# Altium project Carrier-Board-v1.0.PrjPcb (part 11 of 15)

## Sheet RS232_RS485_INTERFACE.SchDoc
size A4; SheetNumber: 18; SheetTotal: 27
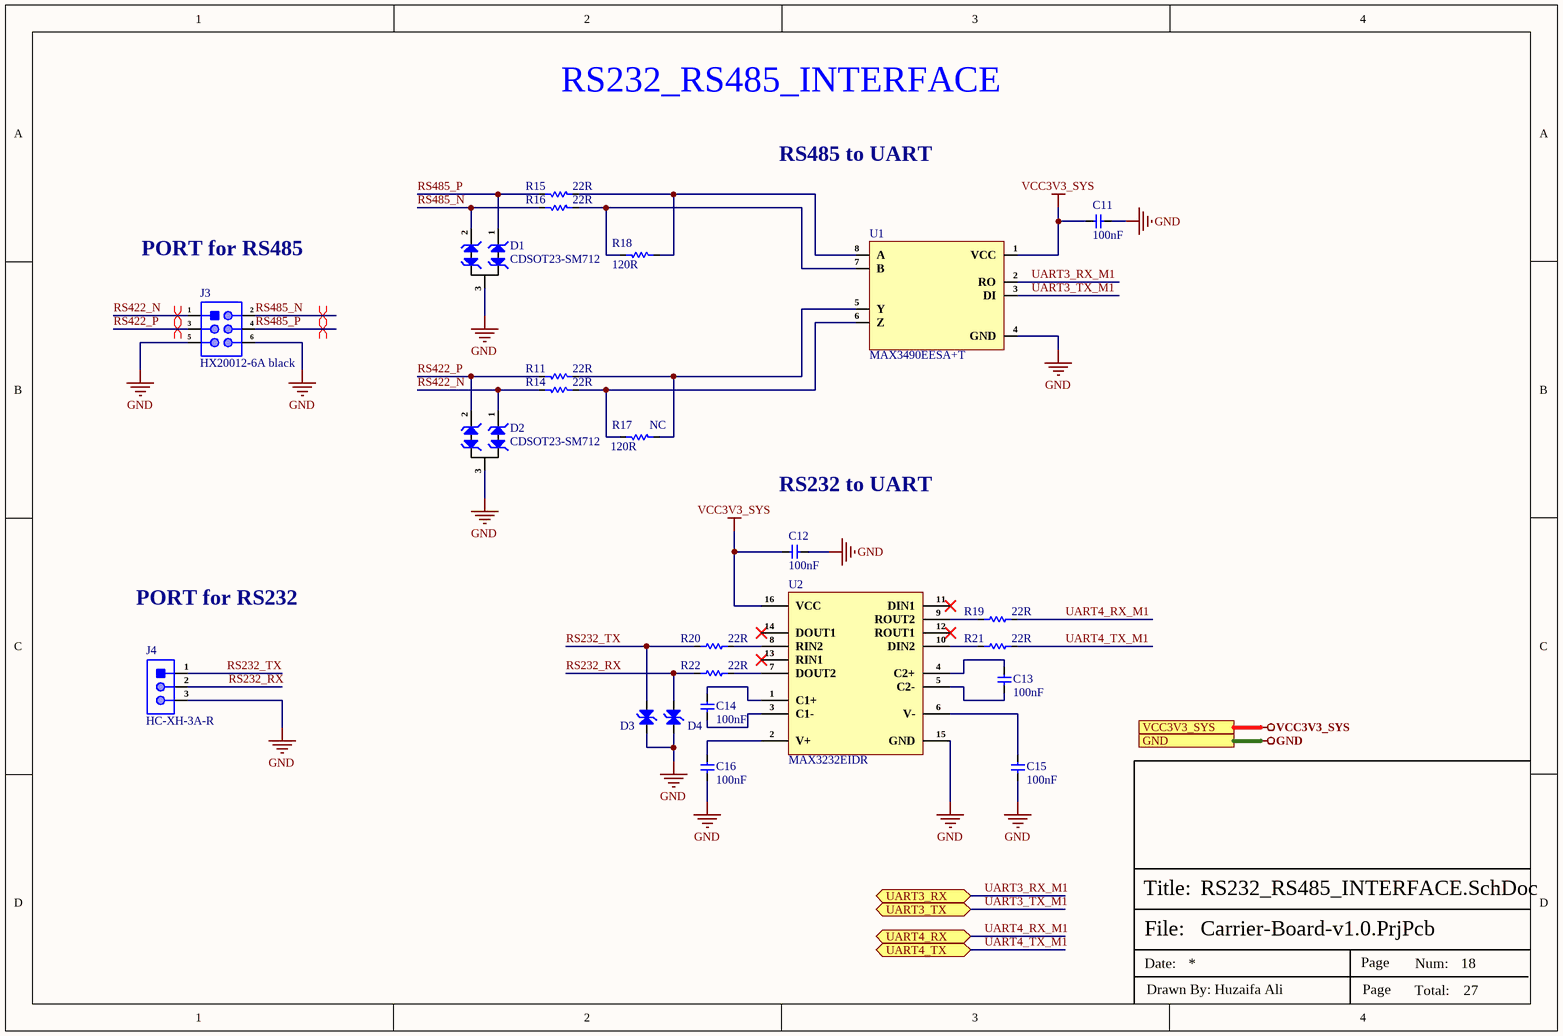
[diagram p17: RS232_RS485_INTERFACE.SchDoc]

### Parts
C11  100nF  [Cap-0402]
C12  100nF  [Cap-0402]
C13  100nF  [Cap-0402]
C14  100nF  [Cap-0402]
C15  100nF  [Cap-0402]
C16  100nF  [Cap-0402]
D1  CDSOT23-SM712  [SOT-23]
D2  CDSOT23-SM712  [SOT-23]
D3  ESD5451N  [DFN1006-2L (Bi-Directional)]  (value not drawn)
D4  ESD5451N  [DFN1006-2L (Bi-Directional)]  (value not drawn)
J3  HX20012-6A black  [HX20012-6A black]
J4  HC-XH-3A-R  [HC-XH-3A-R]
R11  22R  [Res-0402]
R14  22R  [Res-0402]
R15  22R  [Res-0402]
R16  22R  [Res-0402]
R17  NC  [Res-0603]
R18  120R  [Res-0603]
R19  22R  [Res-0402]
R20  22R  [Res-0402]
R21  22R  [Res-0402]
R22  22R  [Res-0402]
U1  MAX3490EESA+T  [SOIC-8(0.154", 3.90mm Width)]
U2  MAX3232EIDR  [SOIC-16]

### Ports
GND (see TOP SHEET[1D], AUDIO_INTERFACE[1D], BUCK REGULATOR[3D], DEBUG_UART_INTERFACE[3D], DIGITAL IO_RELAY_SHEET[5D], DUAL_SIM_INTERFACE[3D], ETHERNET_PHY0[4D], ETHERNET_PHY1[4D], GSM_INTERFACE[2D], HDMI_INTERFACE[3D], INPUT_PROTECTION[3D], LINEAR_VOLTAGE_REG[3D], MICRO_SD_INTERFACE[3D], MIPI-DSI DISPLAY[3D], POWER SECTION[3D], PUSH BUTTONs_INTERFACE[3C], RGB_LEDs_INTERFACE[3D], ROCKCHIP_PWR_SUPPLY[1D], ROCKCHIP_SYSTEM_CONTROL[3C], SENSOR_SHEET[3D], USB2.0_INTERFACE[3D], USB3.0_INTERFACE[3D], USB-C_INTERFACE[2D], WIEGAND_INTERFACE[3D], WIFI_BLUETOOTH_SHEET[4C]), UART3_RX (bidir, see TOP SHEET[2D], DEBUG_UART_INTERFACE[3D]), UART3_TX (bidir, see TOP SHEET[2D], DEBUG_UART_INTERFACE[3D]), UART4_RX (bidir, see TOP SHEET[2D], DEBUG_UART_INTERFACE[3D]), UART4_TX (bidir, see TOP SHEET[2D], DEBUG_UART_INTERFACE[3D]), VCC3V3_SYS (see TOP SHEET[1D], AUDIO_INTERFACE[1D], BUCK REGULATOR[3D], DEBUG_UART_INTERFACE[3D], DIGITAL IO_RELAY_SHEET[5D], ETHERNET_PHY0[4D], ETHERNET_PHY1[4D], GSM_INTERFACE[2D], HDMI_INTERFACE[3D], LINEAR_VOLTAGE_REG[3D], MIPI-DSI DISPLAY[3D], POWER SECTION[3D], PUSH BUTTONs_INTERFACE[3C], ROCKCHIP_PWR_SUPPLY[1D], ROCKCHIP_SYSTEM_CONTROL[3C], SENSOR_SHEET[3D], USB-C_INTERFACE[2D], WIEGAND_INTERFACE[3D], WIFI_BLUETOOTH_SHEET[4C])

### Nets
GND: C11.2 C12.2 C15.2 C16.2 D1.3(GND) D2.3(GND) D3.1(K) D4.1(K) J3.5 J3.6 J4.3 U1.4(GND) U2.15(GND) ; port GND
VCC3V3_SYS: C11.1 C12.1 U1.1(VCC) U2.16(VCC) ; port VCC3V3_SYS
RS232_RX: D4.2(K) J4.2 R22.1
RS232_TX: D3.2(K) J4.1 R20.1
RS422_N: D2.1(IO1) J3.1 R14.2
RS422_P: D2.2(IO2) J3.3 R11.2
RS485_N: D1.2(IO2) J3.2 R16.2
RS485_P: D1.1(IO1) J3.4 R15.2
UART3_RX_M1: U1.2(RO) ; port UART3_RX
UART3_TX_M1: U1.3(DI) ; port UART3_TX
UART4_RX_M1: R19.2 ; port UART4_RX
UART4_TX_M1: R21.2 ; port UART4_TX
NetC13_1: C13.1 U2.4(C2+)
NetC13_2: C13.2 U2.5(C2-)
NetC14_1: C14.1 U2.1(C1+)
NetC14_2: C14.2 U2.3(C1-)
NetC15_1: C15.1 U2.6(V-)
NetC16_1: C16.1 U2.2(V+)
NetR11_1: R11.1 R17.1 U1.5(Y)
NetR14_1: R14.1 R17.2 U1.6(Z)
NetR15_1: R15.1 R18.1 U1.8(A)
NetR16_1: R16.1 R18.2 U1.7(B)
NetR19_1: R19.1 U2.9(ROUT2)
NetR20_2: R20.2 U2.8(RIN2)
NetR21_1: R21.1 U2.10(DIN2)
NetR22_2: R22.2 U2.7(DOUT2)

Not connected (* = marked no-connect by the designer): U2 11(DIN1)* 12(ROUT1)* 13(RIN1)* 14(DOUT1)*

### Layout directives
differential pair; net class RS485; differential pair class DIFF_RS485_120; rule Impedance Constraint [Min = 115.0    Max = 120.0    ]; rule Matched Net Lengths [Tolerance = 0.508mm]: RS422_N, RS422_P, RS485_N, RS485_P

### Notes on the sheet
- RS232_RS485_INTERFACE
- RS485 to UART
- PORT for RS485
- (near R17) 120R
- RS232 to UART
- PORT for RS232
- File:
- Title:
- Date:
- Page
- Num:
- Total:
- Drawn By: Huzaifa Ali

### Library data of the parts
C11-C16 = CC0402KRX5R7BB104: CAP CER 0.1UF 16V X5R 0402; Manufacturer: Yageo; Tolerance: 10%; Supplier 1: Mouser; Manufacturer Part Number: CC0402KRX5R7BB104; RoHS: Yes; Category: Ceramic Capacitors; Stock 1: 936792; Pricing 1: 1=0.10000, 10=0.02300, 50=0.02300, 100=0.01100, 1000=0.00600, 10000=0.00400 (USD); Mount: Surface Mount; Case/Package: 0402; Case Code (Metric): 1005; Case Code (Imperial): 0402; Min Operating Temperature: -55°C; Max Operating Temperature: 85°C; Capacitance: 100nF; Packaging: Tape and Reel; Voltage Rating: 16V; Dielectric: X5R; Termination: SMD/SMT; Voltage Rating (DC): 16V; Package Quantity: 1; Series: CC; Length: 1mm; Width: 0.02inch; Height: 0.5mm; Thickness: 0.022inch; Lead Free: Lead Free; RoHS Compliant: Yes; ComponentLink1URL: https://datasheet.ciiva.com/155/mlccorderingcode-155879.pdf?src-supplier=Digi-Key; ComponentLink1Description: https://datasheet.ciiva.com/155/mlccorderingcode-155879.pdf?src-supplier=Digi-Key; ComponentLink2URL: https://datasheet.ciiva.com/155/mlccorderingcode-155878.pdf?src-supplier=Digi-Key; ComponentLink2Description: https://datasheet.ciiva.com/155/mlccorderingcode-155878.pdf?src-supplier=Digi-Key; ComponentLink3URL: https://datasheet.ciiva.com/155/mlccorderingcode-155880.pdf?src-supplier=Digi-Key; ComponentLink3Description: https://datasheet.ciiva.com/155/mlccorderingcode-155880.pdf?src-supplier=Digi-Key; ComponentLink4URL: https://datasheet.ciiva.com/11464/upy-gphc-x5r-4v-to-50v-12-11464869.pdf?src-supplier=Avnet; ComponentLink4Description: https://datasheet.ciiva.com/11464/upy-gphc-x5r-4v-to-50v-12-11464869.pdf?src-supplier=Avnet; Supplier Part Number 1: 603-CC402KRX5R7BB104; LCSC Part Number: C106204; Number of Pins: 2; Resistor Type: Ceramic; Construction: Flat; Depth: 0.5mm; Radiation Hardening: No; REACH SVHC: Unknown; Halogen Free: Halogen Free
D1 D2 = CDSOT23-SM712: TVS DIODE 7V/12V 14V/26V SOT23-3; Manufacturer: Bourns; Direction: Bidirectional; Value: 75pF; Max Surge Current: 30A; Polarity: Bidirectional,Unidirectional; Number of Channels: 2; Breakdown Voltage: 13.3V; Clamping Voltage: 19V; Working Voltage: 12V; Min Breakdown Voltage: 7.5V; Power Line Protection: No; Leakage Current: 20uA; Peak Pulse Current: 17A; Diode Type: ZENER; Max Power Dissipation: 600W; Peak Pulse Power: 400W; ESD Protection: Yes; Test Current: 1mA; Item Type: Surge Protection (TVS/ESD); Supplier: Rs; Supplier Part Number: 7673728P; Manufacturer Part Number: CDSOT23-SM712; RoHS: Yes; Category: TVS Diodes; Stock: 89660; Pricing: 100=0.935, 1500=0.651, 3000=0.565, 6000=0.553 (GBP); Mounting Technology: Surface Mount; Case/Package: SOT-23; Pins: 3; Contact Plating: Tin; Min Operating Temperature: -55°C; Max Operating Temperature: 150°C; Packaging: Tape and Reel; Series: -; Termination: SMD/SMT; Reverse Standoff Voltage: 12V; Number of Elements: 2; Reverse Breakdown Voltage: 13.3V; Number of Bidirectional Channels: 2; Power Dissipation: 400W; Max Reverse Leakage Current: 20uA; Max Breakdown Voltage: 13.3V; Length: 3.04mm; Width: 0.055inch; Height: 1.11mm; Depth: 1.4mm; Radiation Hardening: No; Reach SVHC Compliant: No; RoHS Compliant: Yes; ComponentLink1URL: https://datasheet.ciiva.com/1281/1670933-1281331.pdf?src-supplier=Farnell; ComponentLink1Description: https://datasheet.ciiva.com/1281/1670933-1281331.pdf?src-supplier=Farnell; ComponentLink2URL: https://datasheet.ciiva.com/4510/cdsot23-sm712-25932-4510261.pdf?src-supplier=Mouser; ComponentLink2Description: https://datasheet.ciiva.com/4510/cdsot23-sm712-25932-4510261.pdf?src-supplier=Mouser; ComponentLink3URL: https://datasheet.ciiva.com/11193/cdsot23-sm712-11193846.pdf?src-supplier=Avnet; ComponentLink3Description: https://datasheet.ciiva.com/11193/cdsot23-sm712-11193846.pdf?src-supplier=Avnet; ComponentLink4URL: https://datasheet.ciiva.com/22696/1670933-22696779.pdf?src-supplier=Element14; ComponentLink4Description: https://datasheet.ciiva.com/22696/1670933-22696779.pdf?src-supplier=Element14; ComponentLink5URL: https://datasheet.ciiva.com/26828/getdatasheetpartid-418501-26828522.pdf?src-supplier=Verical; ComponentLink5Description: https://datasheet.ciiva.com/26828/getdatasheetpartid-418501-26828522.pdf?src-supplier=Verical; ComponentLink6URL: https://datasheet.ciiva.com/337/cdsot23-sm712-337451.pdf?src-supplier=Digikey; ComponentLink6Description: https://datasheet.ciiva.com/337/cdsot23-sm712-337451.pdf?src-supplier=Digikey; ComponentLink7URL: https://datasheet.ciiva.com/337/cdsot23-sm712-337452.pdf?src-supplier=Digikey; ComponentLink7Description: https://datasheet.ciiva.com/337/cdsot23-sm712-337452.pdf?src-supplier=Digikey; LCSC Part Number: C404012
D3 D4 = ESD5451N: DFN1006-2(0402) ESD Protection Devices ROHS; Manufacturer: TECH PUBLIC; Manufacturer Part Number: ESD5451N; Footprint: DFN1006-2(0402); ComponentLink1Description: LCSC; ComponentLink1URL: https://www.lcsc.com/product-detail/span-style-background-color-ff0-ESD-span-Protection-Devices_TECH-PUBLIC-ESD5451N_C2936977.html; LCSC Part Number: C2936977
J3 = HX20012-6A black: 2x3P 2 2mm 2mm male 3 -25℃~+85℃ 3A Straight Plugin,P=2mm Wire To Board / Wire To Wire Connector ROHS; Manufacturer: HX(Zhejiang Yueqing Hongxing Elec); Manufacturer Part Number: HX20012-6A black; Package: Plugin,P=2mm; LCSC Part Number: C469723; Item Type: Wire To Wire Connector; ComponentLink1Description: LCSC; ComponentLink1URL: https://jlcpcb.com/partdetail/475972-HX20012_6Ablack/C469723
J4 = HC-XH-3A-R: 1x3P 3P XH 1 Tin 2.5mm 3 -25℃~+85℃ Brass 3A Straight Plugin,P=2.5mm Wire To Board Connector ROHS; Manufacturer: HCTL; Manufacturer Part Number: HC-XH-3A-R; Package: Plugin,P=2.5mm; LCSC Part Number: C7466690; Item Type: Wire To Board Connector; ComponentLink1Description: LCSC; ComponentLink1URL: https://www.lcsc.com/product-detail/Wire-To-Board-Connector_HCTL-HC-XH-3A-R_C7466690.html
R11 R14-R16 R19-R22 = RC0402FR-0722RL: RES 22 OHM 1% 1/16W 0402; Manufacturer: Yageo; Max Power Dissipation: 63mW; Temperature Coefficient: 100ppm/°C; Voltage Rating: 50V; Power Rating: 62.5mW; Item Type: Resistor; Supplier 1: Avnet; Manufacturer Part Number: RC0402FR-0722RL; Stock 1: 1810000; Pricing 1: 10000=0.00085 (USD); Case/Package: 0402; Case Code (Metric): 1005; Case Code (Imperial): 0402; Min Operating Temperature: -55°C; Max Operating Temperature: 155°C; Packaging: Tape and Reel; Resistance: 22R; Resistor Type: Thick Film; Number of Terminations: 2; Tolerance: 1%; Features: Moisture Resistant; Length: 1mm; Width: 0.5mm; Height: 0.32mm; RoHS Compliant: Yes; ComponentLink1URL: https://datasheet.ciiva.com/11819/0900766b80c66297-11819462.pdf?src-supplier=RSComponents; ComponentLink1Description: https://datasheet.ciiva.com/11819/0900766b80c66297-11819462.pdf?src-supplier=RSComponents; Supplier Part Number 1: RC0402FR-0722RL; LCSC Part Number: C114765; RoHS: Yes; Category: Chip SMD Resistors; Number of Pins: 2; Size Code: 0402; Voltage Rating (DC): 50V; Termination: SMD/SMT; Series: RC; Resistance Tolerance: 1%; Technology: THICK FILM; Construction: Rectangular; Depth: 0.5mm; Reach SVHC Compliant: Yes; Military Standard: Not; Lead Free: Lead Free; ComponentLink2URL: https://datasheet.ciiva.com/7849/1018594-7849912.pdf?src-supplier=Element14; ComponentLink2Description: https://datasheet.ciiva.com/7849/1018594-7849912.pdf?src-supplier=Element14; ComponentLink3URL: https://datasheet.ciiva.com/7849/1018594-7849911.pdf?src-supplier=Element14; ComponentLink3Description: https://datasheet.ciiva.com/7849/1018594-7849911.pdf?src-supplier=Element14; ComponentLink4URL: https://datasheet.ciiva.com/16930/pyu-rc0402-51-rohs-l-6-r-16930687.pdf?src-supplier=Future+Electronics; ComponentLink4Description: https://datasheet.ciiva.com/16930/pyu-rc0402-51-rohs-l-6-r-16930687.pdf?src-supplier=Future+Electronics; ComponentLink5URL: https://datasheet.ciiva.com/26829/getdatasheetpartid-554995-26829991.pdf?src-supplier=Verical; ComponentLink5Description: https://datasheet.ciiva.com/26829/getdatasheetpartid-554995-26829991.pdf?src-supplier=Verical
R17 = RT0603BRB07120RL: RES SMD 120 OHM 0.1% 1/10W 0603; Manufacturer: Yageo; Temperature Coefficient: 10ppm/°C; Voltage Rating: 75V; Max Power Dissipation: 100mW; Value: 120R; Item Type: Resistor; Manufacturer Part Number: RT0603BRB07120RL; RoHS: Yes; Category: Chip SMD Resistors; Case/Package: 0603; Min Operating Temperature: -55°C; Max Operating Temperature: 155°C; Tolerance: 0.1%; Packaging: Tape and Reel; Number of Terminations: 2; Features: Moisture Resistant; Series: RT; Length: 0.063inch; Width: 0.031inch; Height: 0.022inch; RoHS Compliant: Yes; ComponentLink1URL: http://www.yageo.com/documents/recent/PYu-RT_1-to-0.01_RoHS_L_8.pdf?src-supplier=Digikey; ComponentLink1Description: http://www.yageo.com/documents/recent/PYu-RT_1-to-0.01_RoHS_L_8.pdf?src-supplier=Digikey; LCSC Part Number: C860088; Supplier: Digikey; Supplier Part Number: RT0603BRB07120RL-ND; Pricing: 5000=0.13797 (USD)
R18 = RT0603BRB07120RL: RES SMD 120 OHM 0.1% 1/10W 0603; Manufacturer: Yageo; Temperature Coefficient: 10ppm/°C; Voltage Rating: 75V; Max Power Dissipation: 100mW; Item Type: Resistor; Manufacturer Part Number: RT0603BRB07120RL; RoHS: Yes; Category: Chip SMD Resistors; Case/Package: 0603; Min Operating Temperature: -55°C; Max Operating Temperature: 155°C; Tolerance: 0.1%; Packaging: Tape and Reel; Number of Terminations: 2; Features: Moisture Resistant; Series: RT; Length: 0.063inch; Width: 0.031inch; Height: 0.022inch; RoHS Compliant: Yes; ComponentLink1URL: http://www.yageo.com/documents/recent/PYu-RT_1-to-0.01_RoHS_L_8.pdf?src-supplier=Digikey; ComponentLink1Description: http://www.yageo.com/documents/recent/PYu-RT_1-to-0.01_RoHS_L_8.pdf?src-supplier=Digikey; LCSC Part Number: C860088; Supplier: Digikey; Supplier Part Number: RT0603BRB07120RL-ND; Pricing: 5000=0.13797 (USD); Value: 120R
U1 = MAX3490EESA+T: IC TXRX RS485/422 10MBPS 8SOIC; Manufacturer: Maxim; Supplier: Mouser; Supplier Part Number: 700-MAX3490EESAT; Manufacturer Part Number: MAX3490EESA+T; RoHS: Yes; Item Type: IC; Stock: 5952; Pricing: 1=5.92, 10=5.35, 50=5.1, 100=4.43, 1000=4.38, 10000=4.34 (USD); ComponentLink1URL: https://datasheet.ciiva.com/3029/max3483e-max3491e-3029646.pdf?src-supplier=Avnet; ComponentLink1Description: https://datasheet.ciiva.com/3029/max3483e-max3491e-3029646.pdf?src-supplier=Avnet; ComponentLink2URL: https://datasheet.ciiva.com/1775/max3483-max3491-1775008.pdf?src-supplier=Digikey; ComponentLink2Description: https://datasheet.ciiva.com/1775/max3483-max3491-1775008.pdf?src-supplier=Digikey; LCSC Part Number: C5342105
U2 = MAX3232EIDR: IC RS232 LINE DVR/RCVR 16-SOIC; Manufacturer: Texas Instruments; Number of Transmitters: 2; Data Rate: 250Kbps; Operating Supply Voltage: 5V; Logic Function: Transceiver,Receiver; Number of Transceivers: 1; Supply Current: 1mA; Max Supply Voltage: 5.5V; Min Supply Voltage: 3V; Simplex/Duplex: Full Duplex; Propagation Delay: 0.3us; Supplier 1: Mouser; Manufacturer Part Number: MAX3232EIDR; RoHS: Yes; Category: Interface ICs; Stock 1: 49030; Pricing 1: 1=1.79, 10=1.56, 50=1.56, 100=1.44, 1000=1.44, 10000=1.41 (USD); Mount: Surface Mount; Case/Package: D; Number of Pins: 16; Weight: 0.014829oz; Min Operating Temperature: -40°C; Max Operating Temperature: 85°C; Package Quantity: 1; Packaging: Tape and Reel; Number of Receivers: 2; Number of Drivers: 2; Series: -; Operating Supply Current: 1mA; Radiation Hardening: No; Lead Free: Lead Free; RoHS Compliant: Yes; Reach SVHC Compliant: No; ComponentLink1URL: https://datasheet.ciiva.com/46394/1863621-46394524.pdf?src-supplier=Element14; ComponentLink1Description: https://datasheet.ciiva.com/46394/1863621-46394524.pdf?src-supplier=Element14; ComponentLink2URL: https://datasheet.ciiva.com/46398/1863621-46398054.pdf?src-supplier=Element14; ComponentLink2Description: https://datasheet.ciiva.com/46398/1863621-46398054.pdf?src-supplier=Element14; ComponentLink3URL: https://datasheet.ciiva.com/1703/max3232e-1703394.pdf?src-supplier=Digikey; ComponentLink3Description: https://datasheet.ciiva.com/1703/max3232e-1703394.pdf?src-supplier=Digikey; ComponentLink4URL: https://datasheet.ciiva.com/1703/max3232e-1703393.pdf?src-supplier=Digikey; ComponentLink4Description: https://datasheet.ciiva.com/1703/max3232e-1703393.pdf?src-supplier=Digikey; ComponentLink5URL: https://datasheet.ciiva.com/1703/max3232e-1703395.pdf?src-supplier=Digikey; ComponentLink5Description: https://datasheet.ciiva.com/1703/max3232e-1703395.pdf?src-supplier=Digikey; ComponentLink6URL: https://datasheet.ciiva.com/15151/getdatasheetpartid-49711-15151143.pdf?src-supplier=Verical; ComponentLink6Description: https://datasheet.ciiva.com/15151/getdatasheetpartid-49711-15151143.pdf?src-supplier=Verical; Supplier Part Number 1: 595-MAX3232EIDR; Item Type: IC

## Sheet DEBUG_UART_INTERFACE.SchDoc
size A4; SheetNumber: 19; SheetTotal: 27
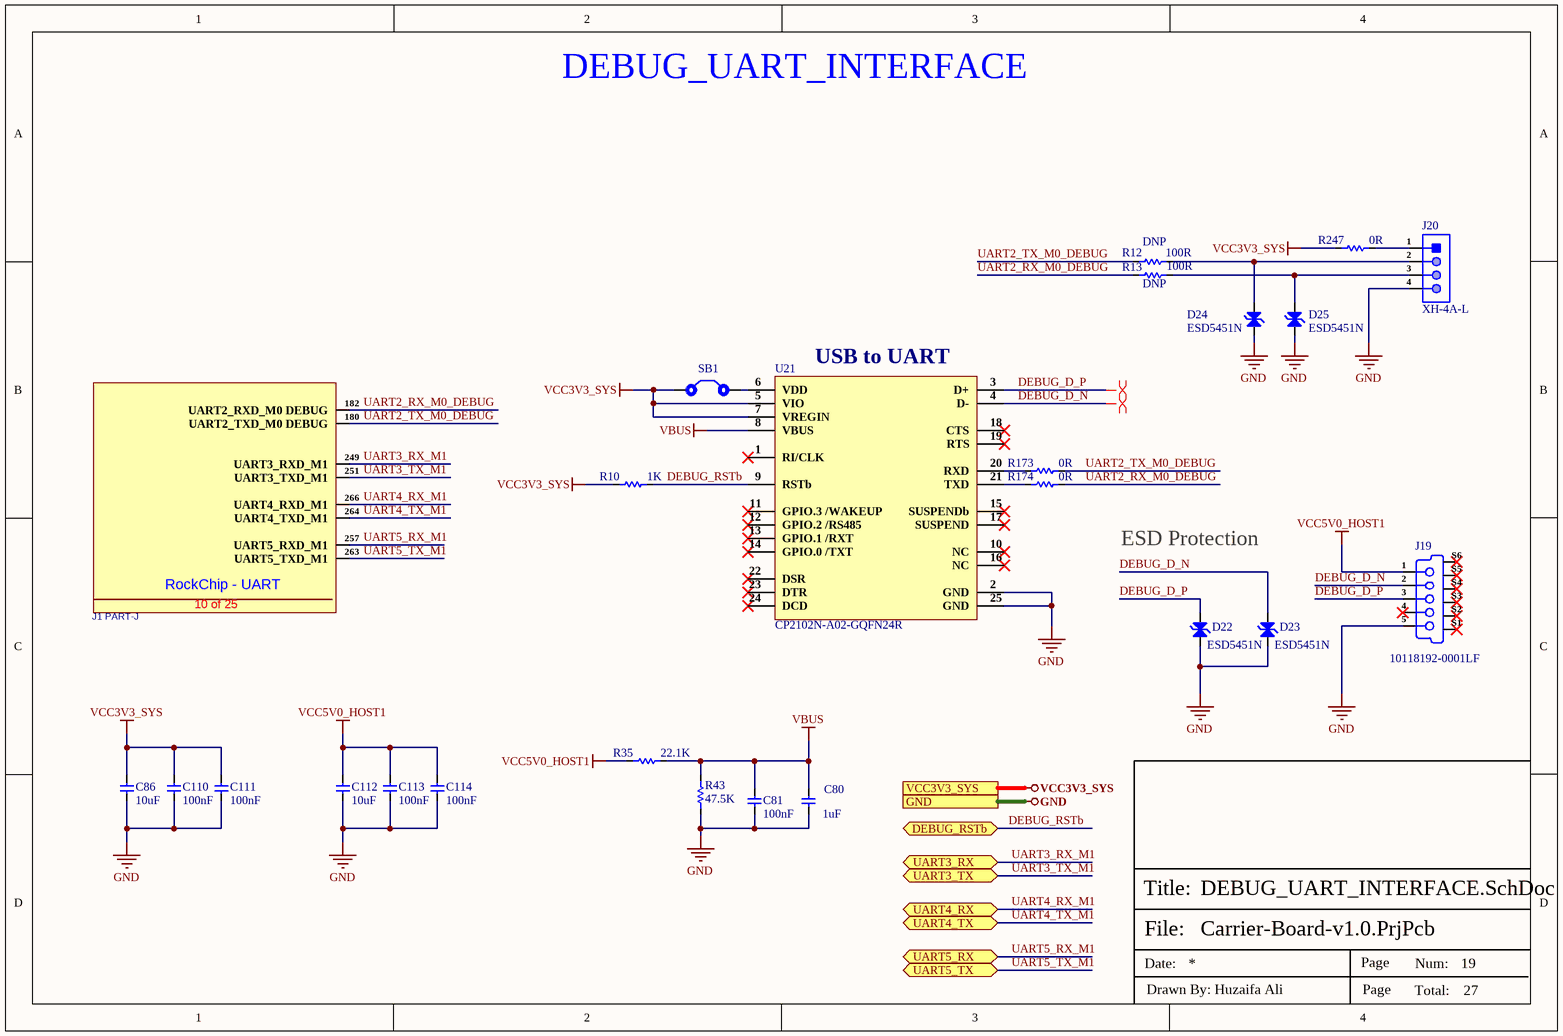
[diagram p18: DEBUG_UART_INTERFACE.SchDoc]

### Parts
C80  1uF  [Cap-0402]
C81  100nF  [Cap-0402]
C86  10uF  [Cap-0603]
C110  100nF  [Cap-0402]
C111  100nF  [Cap-0402]
C112  10uF  [Cap-0603]
C113  100nF  [Cap-0402]
C114  100nF  [Cap-0402]
D22  ESD5451N  [DFN1006-2L (Bi-Directional)]
D23  ESD5451N  [DFN1006-2L (Bi-Directional)]
D24  ESD5451N  [DFN1006-2L (Bi-Directional)]
D25  ESD5451N  [DFN1006-2L (Bi-Directional)]
J1_PART-  AS0B826-S78B-7H  [AS0B826-S78B-7H]  (value not drawn)  (part J of 25)
J19  10118192-0001LF  [10118192-0001LF_]
J20  XH-4A-L  [XH-4A-L]
R10  1K  [Res-0402]
R12  DNP  [Res-0402]
R13  DNP  [Res-0402]
R35  22.1K  [Res-0603]
R43  47.5K  [Res-0603]
R173  0R  [Res-0402]
R174  0R  [Res-0402]
R247  0R  [Res-0402]
SB1  Solder Bridge 0402  [Solder Bridge 0402]  (value not drawn)  (no BOM)
U21  CP2102N-A02-GQFN24R  [CP2102N-A02-GQFN24R]

### Ports
DEBUG_RSTb (bidir, see TOP SHEET[2D], ROCKCHIP_GPIO_NC PINS[3D]), GND (see TOP SHEET[2D], AUDIO_INTERFACE[1D], BUCK REGULATOR[3D], DIGITAL IO_RELAY_SHEET[5D], DUAL_SIM_INTERFACE[3D], ETHERNET_PHY0[4D], ETHERNET_PHY1[4D], GSM_INTERFACE[2D], HDMI_INTERFACE[3D], INPUT_PROTECTION[3D], LINEAR_VOLTAGE_REG[3D], MICRO_SD_INTERFACE[3D], MIPI-DSI DISPLAY[3D], POWER SECTION[3D], PUSH BUTTONs_INTERFACE[3C], RGB_LEDs_INTERFACE[3D], ROCKCHIP_PWR_SUPPLY[1D], ROCKCHIP_SYSTEM_CONTROL[3C], RS232_RS485_INTERFACE[3C], SENSOR_SHEET[3D], USB2.0_INTERFACE[3D], USB3.0_INTERFACE[3D], USB-C_INTERFACE[2D], WIEGAND_INTERFACE[3D], WIFI_BLUETOOTH_SHEET[4C]), UART3_RX (bidir, see TOP SHEET[2D], RS232_RS485_INTERFACE[3D]), UART3_TX (bidir, see TOP SHEET[2D], RS232_RS485_INTERFACE[3D]), UART4_RX (bidir, see TOP SHEET[2D], RS232_RS485_INTERFACE[3D]), UART4_TX (bidir, see TOP SHEET[2D], RS232_RS485_INTERFACE[3D]), UART5_RX (bidir, see TOP SHEET[2D], GSM_INTERFACE[3C]), UART5_TX (bidir, see TOP SHEET[2D], GSM_INTERFACE[3D]), VCC3V3_SYS (see TOP SHEET[2D], AUDIO_INTERFACE[1D], BUCK REGULATOR[3D], DIGITAL IO_RELAY_SHEET[5D], ETHERNET_PHY0[4D], ETHERNET_PHY1[4D], GSM_INTERFACE[2D], HDMI_INTERFACE[3D], LINEAR_VOLTAGE_REG[3D], MIPI-DSI DISPLAY[3D], POWER SECTION[3D], PUSH BUTTONs_INTERFACE[3C], ROCKCHIP_PWR_SUPPLY[1D], ROCKCHIP_SYSTEM_CONTROL[3C], RS232_RS485_INTERFACE[3C], SENSOR_SHEET[3D], USB-C_INTERFACE[2D], WIEGAND_INTERFACE[3D], WIFI_BLUETOOTH_SHEET[4C])

### Nets
GND: C80.2 C81.2 C86.1 C110.1 C111.1 C112.1 C113.1 C114.1 D22.1(K) D23.1(K) D24.1(K) D25.1(K) J19.5(GND) J20.4 R43.2 U21.2(GND) U21.25(GND) ; port GND
VBUS: C80.1 C81.1 R35.2 R43.1 U21.8(VBUS)
VCC3V3_SYS: C86.2 C110.2 C111.2 R10.1 R247.1 SB1.1 U21.5(VIO) U21.7(VREGIN) ; port VCC3V3_SYS
VCC5V0_HOST1: C112.2 C113.2 C114.2 J19.1(V_BUS_(5V)) R35.1
DEBUG_D_N: D23.2(K) J19.2(D-) U21.4(D-)
DEBUG_D_P: D22.2(K) J19.3(D+) U21.3(D+)
DEBUG_RSTb: R10.2 U21.9(RSTb) ; port DEBUG_RSTb
UART2_RX_M0_DEBUG: J1_PART-.182(UART2_RXD_M0_DEBUG) R13.1 R174.2
UART2_TX_M0_DEBUG: J1_PART-.180(UART2_TXD_M0_DEBUG) R12.1 R173.2
UART3_RX_M1: J1_PART-.249(UART3_RXD_M1) ; port UART3_RX
UART3_TX_M1: J1_PART-.251(UART3_TXD_M1) ; port UART3_TX
UART4_RX_M1: J1_PART-.266(UART4_RXD_M1) ; port UART4_RX
UART4_TX_M1: J1_PART-.264(UART4_TXD_M1) ; port UART4_TX
UART5_RX_M1: J1_PART-.257(UART5_RXD_M1) ; port UART5_RX  [project net UART5_RX]
UART5_TX_M1: J1_PART-.263(UART5_TXD_M1) ; port UART5_TX  [project net UART5_TX]
NetD24_2: D24.2(K) J20.2 R12.2
NetD25_2: D25.2(K) J20.3 R13.2
NetJ20_1: J20.1 R247.2
NetR173_1: R173.1 U21.20(RXD)
NetR174_1: R174.1 U21.21(TXD)
NetSB1_2: SB1.2 U21.6(VDD)

Not connected (* = marked no-connect by the designer): J19 4(NC)* S1(Shield)* S2(Shield)* S3(Shield)* S4(Shield)* S5(Shield)* S6(Shield)*; U21 1(RI/CLK)* 10(NC)* 11(GPIO.3_/WAKEUP)* 12(GPIO.2_/RS485)* 13(GPIO.1_/RXT)* 14(GPIO.0_/TXT)* 15(SUSPENDb)* 16(NC)* 17(SUSPEND)* 18(CTS)* 19(RTS)* 22(DSR)* 23(DTR)* 24(DCD)*

### Layout directives
differential pair; differential pair class D1_Lines; net class D1: DEBUG_D_P
differential pair; net class D1; differential pair class D1_Lines: DEBUG_D_N

### Notes on the sheet
- DEBUG_UART_INTERFACE
- (near R12) 100R
- 100R
- (near U21) USB to UART
- ESD Protection
- File:
- Title:
- Date:
- Page
- Num:
- Total:
- Drawn By: Huzaifa Ali
- (in symbol AS0B826-S78B-7H, part J) RockChip - UART; 10 of 25

### Library data of the parts
C80 = CC0402KRX5R8BB105: CAP CER 1UF 25V X5R 0402; Manufacturer: Yageo; Tolerance: 10%; Supplier 1: Mouser; Manufacturer Part Number: CC0402KRX5R8BB105; RoHS: Yes; Category: Ceramic Capacitors; Stock 1: 91975; Pricing 1: 1=0.30000, 10=0.20400, 50=0.20400, 100=0.11600, 1000=0.07200, 10000=0.05900 (USD); Mount: Surface Mount; Case/Package: 0402; Case Code (Metric): 1005; Case Code (Imperial): 0402; Min Operating Temperature: -55°C; Max Operating Temperature: 85°C; Capacitance: 1uF; Dielectric: X5R; Package Quantity: 10000; Voltage Rating: 25V; Packaging: Tape and Reel; Termination: SMD/SMT; Voltage Rating (DC): 25V; Length: 0.039inch; Width: 0.02inch; Thickness: 0.022inch; Lead Free: Lead Free; Halogen Free: Halogen Free; RoHS Compliant: Yes; ComponentLink1URL: http://www.mouser.com/ds/2/447/Yageo_UPY-GP_NP0_16V-to-50V_9-358835.pdf?src-supplier=Mouser; ComponentLink1Description: http://www.mouser.com/ds/2/447/Yageo_UPY-GP_NP0_16V-to-50V_9-358835.pdf?src-supplier=Mouser; ComponentLink2URL: http://www.yageo.com/documents/recent/UPY-GPHC_X5R_4V-to-50V_25.pdf?src-supplier=Digi-Key; ComponentLink2Description: http://www.yageo.com/documents/recent/UPY-GPHC_X5R_4V-to-50V_25.pdf?src-supplier=Digi-Key; ComponentLink3URL: https://4donline.ihs.com/images/VipMasterIC/IC/YAGO/YAGO-S-A0006851646/YAGO-S-A0006851646-1.pdf?hkey=6D3A4C79FDBF58556ACFDE234799DDF0&src-supplier=Newark; ComponentLink3Description: https://4donline.ihs.com/images/VipMasterIC/IC/YAGO/YAGO-S-A0006851646/YAGO-S-A0006851646-1.pdf?hkey=6D3A4C79FDBF58556ACFDE234799DDF0&src-supplier=Newark; Supplier Part Number 1: 603-CC402KRX5R8BB105; LCSC Part Number: C326568; Weight: 2.3E-05oz
C81 C110 C111 C113 C114 = CC0402KRX5R7BB104: as C11 on sheet RS232_RS485_INTERFACE; Manufacturer Part Number: CC0402KRX5R7BB104; RoHS: Yes; Category: Ceramic Capacitors; Supplier 1: Mouser; Stock 1: 936792; Pricing 1: 1=0.10000, 10=0.02300, 50=0.02300, 100=0.01100, 1000=0.00600, 10000=0.00400 (USD); Mount: Surface Mount; Case/Package: 0402; Number of Pins: 2; Case Code (Metric): 1005; Case Code (Imperial): 0402; Min Operating Temperature: -55°C; Max Operating Temperature: 85°C; Capacitance: 100nF; Dielectric: X5R; Packaging: Tape and Reel; Voltage Rating: 16V; Package Quantity: 1; Voltage Rating (DC): 16V; Termination: SMD/SMT; Resistor Type: Ceramic; Series: CC; Construction: Flat; Length: 1mm; Width: 0.02inch; Height: 0.5mm; Thickness: 0.022inch; Depth: 0.5mm; Radiation Hardening: No; REACH SVHC: Unknown; Lead Free: Lead Free; Halogen Free: Halogen Free; RoHS Compliant: Yes; ComponentLink1URL: https://datasheet.ciiva.com/155/mlccorderingcode-155879.pdf?src-supplier=Digi-Key; ComponentLink1Description: https://datasheet.ciiva.com/155/mlccorderingcode-155879.pdf?src-supplier=Digi-Key; ComponentLink2URL: https://datasheet.ciiva.com/155/mlccorderingcode-155878.pdf?src-supplier=Digi-Key; ComponentLink2Description: https://datasheet.ciiva.com/155/mlccorderingcode-155878.pdf?src-supplier=Digi-Key; ComponentLink3URL: https://datasheet.ciiva.com/155/mlccorderingcode-155880.pdf?src-supplier=Digi-Key; ComponentLink3Description: https://datasheet.ciiva.com/155/mlccorderingcode-155880.pdf?src-supplier=Digi-Key; ComponentLink4URL: https://datasheet.ciiva.com/11464/upy-gphc-x5r-4v-to-50v-12-11464869.pdf?src-supplier=Avnet; ComponentLink4Description: https://datasheet.ciiva.com/11464/upy-gphc-x5r-4v-to-50v-12-11464869.pdf?src-supplier=Avnet; Supplier Part Number 1: 603-CC402KRX5R7BB104; LCSC Part Number: C106204
C86 C112 = C1608X5R1E106M080AC: CAP CER 10UF 25V X5R 0603; Manufacturer: TDK; Tolerance: 20%; Dielectric Material: Ceramic; Item Type: Capacitor; Manufacturer Part Number: C1608X5R1E106M080AC; Supplier 1: Digi-Key; Stock 1: 61681; Pricing 1: 1=0.96, 10=0.704, 100=0.483, 500=0.38238, 1000=0.322 (USD); Mount: Surface Mount; Case/Package: 0603; Case Code (Metric): 1608; Case Code (Imperial): 0603; Min Operating Temperature: -55°C; Max Operating Temperature: 85°C; Capacitance: 10uF; Dielectric: X5R; Packaging: Tape and Reel; Voltage Rating: 25V; Package Quantity: 1; Voltage Rating (DC): 25V; Termination: SMD/SMT; Length: 1.6mm; Width: 0.8mm; Height: 0.8mm; Thickness: 0.039inch; Depth: 0.8mm; REACH SVHC: No SVHC; Lead Free: Lead Free; Supplier Part Number 1: 445-9015-1-ND; LCSC Part Number: C2168289; Weight: 7.1E-05oz; Composition: Ceramic
D22-D25 = ESD5451N: as D3 on sheet RS232_RS485_INTERFACE; Manufacturer Part Number: ESD5451N; Footprint: DFN1006-2(0402); ComponentLink1Description: LCSC; ComponentLink1URL: https://www.lcsc.com/product-detail/span-style-background-color-ff0-ESD-span-Protection-Devices_TECH-PUBLIC-ESD5451N_C2936977.html; LCSC Part Number: C2936977
J1_PART- = AS0B826-S78B-7H: SMD,P=0.5mm,Surface Mount，Right Angle; Manufacturer: FOXCONN; Item Type: Card Edge Connectors; Supplier: LCSC; Manufacturer Part Number: AS0B826-S78B-7H; RoHS: No; Stock: 4979; Pricing: 1=9.21, 10=8.287, 25=7.8064, 50=7.6064, 100=7.4062 (USD); LCSC Part Number: C426232
J19 = 10118192-0001LF: CONN RCPT USB2.0 MICRO B SMD R/A; Manufacturer: Amphenol FCI; Gender: Receptacle; Current Rating: 1.8A; Connector Type: USB,Receptacle; Number of Contacts: 5; Number of Ports: 1; Insulation Resistance: 1GR; Max Voltage Rating (AC): 100V; Pitch: 0.65mm; Item Type: USB Connector; Supplier 1: Digi-Key; Manufacturer Part Number: 10118192-0001LF; Stock 1: 32977; Pricing 1: 1=0.43, 10=0.405, 25=0.3648, 50=0.3242, 100=0.3107, 250=0.28368, 500=0.27016 (USD); Mount: Surface Mount,Horizontal; Contact Plating: Gold; Contact Material: Copper Alloy; Color: Black; Number of Terminals: 5; Housing Material: Polymer; Min Operating Temperature: -55°C; Max Operating Temperature: 85°C; Termination: Solder; Packaging: Tape and Reel; Orientation: Right Angle; Package Quantity: 1400; Features: Shielded; Voltage Rating: 100V; USB Standard: USB 2.0; Length: 7.86mm; Depth: 5.57mm; Radiation Hardening: No; Flammability Rating: UL94 V-0; Lead Free: Lead Free; REACH SVHC: No SVHC; ComponentLink1URL: https://cdn.amphenol-icc.com/media/wysiwyg/files/documentation/datasheet/inputoutput/io_usb_micro.pdf?src-supplier=Verical; ComponentLink1Description: https://cdn.amphenol-icc.com/media/wysiwyg/files/documentation/datasheet/inputoutput/io_usb_micro.pdf?src-supplier=Verical; ComponentLink2URL: http://www.amphenol-icc.com/media/wysiwyg/files/drawing/10118192.pdf?src-supplier=Digi-Key; ComponentLink2Description: http://www.amphenol-icc.com/media/wysiwyg/files/drawing/10118192.pdf?src-supplier=Digi-Key; ComponentLink3URL: https://cdn.amphenol-icc.com/media/wysiwyg/files/documentation/datasheet/inputoutput/io_usb_micro.pdf?src-supplier=Mouser; ComponentLink3Description: https://cdn.amphenol-icc.com/media/wysiwyg/files/documentation/datasheet/inputoutput/io_usb_micro.pdf?src-supplier=Mouser; Supplier Part Number 1: 609-4613-6-ND; LCSC Part Number: C132564
J20 = XH-4A-L: 1x4P 4P XH 1 Tin 2.5mm 4 -25℃~+85℃ Brass 3A Straight Plugin,P=2.5mm Wire To Board Connector ROHS; Manufacturer: HCTL; Manufacturer Part Number: XH-4A-L; Package: Plugin,P=2.5mm; LCSC Part Number: C2979569; Item Type: Wire To Board Connector; ComponentLink1Description: LCSC; ComponentLink1URL: https://www.lcsc.com/product-detail/Wire-To-Board-Connector_HCTL-XH-4A-L_C2979569.html
R10 = RC0402FR-071KL: RES 1K OHM 1% 1/16W 0402; Manufacturer: Yageo; Resistance: 1kR; Temperature Coefficient: 100ppm/°C; Voltage Rating (DC): 50V; Power Rating: 62.5mW; Max Power Dissipation: 63mW; Item Type: Resistor; Supplier 1: Avnet; Manufacturer Part Number: RC0402FR-071KL; RoHS: Yes; Category: Chip SMD Resistors; Stock 1: 13030000; Pricing 1: 10000=0.00085, 20000=0.00087, 40000=0.00084, 60000=0.00083, 80000=0.00079, 100000=0.00078, 1000000=0.00076 (USD); Case/Package: 0402; Number of Pins: 2; Case Code (Imperial): 0402; Case Code (Metric): 1005; Size Code: 0402; Min Operating Temperature: -55°C; Max Operating Temperature: 155°C; Resistor Type: Thick Film; Tolerance: 1%; Packaging: Tape and Reel; Voltage Rating: 50V; Termination: SMD/SMT; Features: Moisture Resistant; Series: RC; Number of Terminations: 2; Resistance Tolerance: 1%; Construction: Rectangular; Technology: THICK FILM; Length: 1mm; Width: 0.5mm; Height: 0.32mm; Depth: 0.5mm; Reach SVHC Compliant: Yes; Lead Free: Lead Free; RoHS Compliant: Yes; Military Standard: Not; ComponentLink1URL: https://datasheet.ciiva.com/11819/0900766b80c66297-11819477.pdf?src-supplier=RSComponents; ComponentLink1Description: https://datasheet.ciiva.com/11819/0900766b80c66297-11819477.pdf?src-supplier=RSComponents; ComponentLink2URL: https://datasheet.ciiva.com/7983/1018594-7983502.pdf?src-supplier=Element14; ComponentLink2Description: https://datasheet.ciiva.com/7983/1018594-7983502.pdf?src-supplier=Element14; ComponentLink3URL: https://datasheet.ciiva.com/22747/1018594-22747513.pdf?src-supplier=Element14; ComponentLink3Description: https://datasheet.ciiva.com/22747/1018594-22747513.pdf?src-supplier=Element14; ComponentLink4URL: https://datasheet.ciiva.com/12666/pyu-rc0402-51-rohs-l-6-r-12666741.pdf?src-supplier=Mouser; ComponentLink4Description: https://datasheet.ciiva.com/12666/pyu-rc0402-51-rohs-l-6-r-12666741.pdf?src-supplier=Mouser; ComponentLink5URL: https://datasheet.ciiva.com/7849/1018594-7849869.pdf?src-supplier=Element14; ComponentLink5Description: https://datasheet.ciiva.com/7849/1018594-7849869.pdf?src-supplier=Element14; ComponentLink6URL: https://datasheet.ciiva.com/7849/1018594-7849871.pdf?src-supplier=Element14; ComponentLink6Description: https://datasheet.ciiva.com/7849/1018594-7849871.pdf?src-supplier=Element14; ComponentLink7URL: https://datasheet.ciiva.com/17063/pyu-rc0402-51-rohs-l-6-r-17063193.pdf?src-supplier=Future+Electronics; ComponentLink7Description: https://datasheet.ciiva.com/17063/pyu-rc0402-51-rohs-l-6-r-17063193.pdf?src-supplier=Future+Electronics; Supplier Part Number 1: RC0402FR-071KL; LCSC Part Number: C106235
R12 R13 = RC0402FR-07100RL: RES 100 OHM 1% 1/16W 0402; Manufacturer: Yageo; Power Rating: 62.5mW; Voltage Rating: 50V; Resistance: 100R; Temperature Coefficient: 100ppm/°C; Max Power Dissipation: 63mW; Item Type: Resistor; Supplier 1: Mouser; Manufacturer Part Number: RC0402FR-07100RL; RoHS: Yes; Category: Chip SMD Resistors; Stock 1: 699545; Pricing 1: 1=0.10000, 10=0.01200, 50=0.01200, 100=0.00500, 1000=0.00300, 2500=0.00200, 10000=0.00100 (USD); Case/Package: 0402; Number of Pins: 2; Case Code (Imperial): 0402; Case Code (Metric): 1005; Size Code: 0402; Min Operating Temperature: -55°C; Max Operating Temperature: 155°C; Tolerance: 1%; Voltage Rating (DC): 50V; Packaging: Tape and Reel; Termination: SMD/SMT; Resistor Type: Thick Film; Features: Moisture Resistant; Series: RC; Number of Terminations: 2; Resistance Tolerance: 1%; Construction: Rectangular; Technology: THICK FILM; Length: 1mm; Width: 0.5mm; Height: 0.32mm; Depth: 0.5mm; RoHS Compliant: Yes; REACH SVHC: No SVHC; Military Standard: Not; Lead Free: Lead Free; ComponentLink1URL: https://datasheet.ciiva.com/11808/0900766b80c66297-11808765.pdf?src-supplier=RSComponents; ComponentLink1Description: https://datasheet.ciiva.com/11808/0900766b80c66297-11808765.pdf?src-supplier=RSComponents; ComponentLink2URL: https://datasheet.ciiva.com/7849/1784430-7849810.pdf?src-supplier=Element14; ComponentLink2Description: https://datasheet.ciiva.com/7849/1784430-7849810.pdf?src-supplier=Element14; ComponentLink3URL: https://datasheet.ciiva.com/28367/1018594-28367226.pdf?src-supplier=Element14; ComponentLink3Description: https://datasheet.ciiva.com/28367/1018594-28367226.pdf?src-supplier=Element14; ComponentLink4URL: https://datasheet.ciiva.com/22747/1018594-22747511.pdf?src-supplier=Element14; ComponentLink4Description: https://datasheet.ciiva.com/22747/1018594-22747511.pdf?src-supplier=Element14; ComponentLink5URL: https://datasheet.ciiva.com/12667/pyu-rc0402-51-rohs-l-6-r-12667957.pdf?src-supplier=Mouser; ComponentLink5Description: https://datasheet.ciiva.com/12667/pyu-rc0402-51-rohs-l-6-r-12667957.pdf?src-supplier=Mouser; ComponentLink6URL: https://datasheet.ciiva.com/15189/getdatasheetpartid-329466-15189335.pdf?src-supplier=Verical; ComponentLink6Description: https://datasheet.ciiva.com/15189/getdatasheetpartid-329466-15189335.pdf?src-supplier=Verical; ComponentLink7URL: https://datasheet.ciiva.com/16740/pyu-rc0402-51-rohs-l-6-r-16740566.pdf?src-supplier=Future+Electronics; ComponentLink7Description: https://datasheet.ciiva.com/16740/pyu-rc0402-51-rohs-l-6-r-16740566.pdf?src-supplier=Future+Electronics; Supplier Part Number 1: 603-RC0402FR-07100RL; LCSC Part Number: C106232
R35 = RC0603FR-0722K1L: RES 22.1K OHM 1% 1/10W 0603; Manufacturer: Yageo; Power Rating: 100mW; Resistance: 22.1kR; Voltage Rating: 50V; Temperature Coefficient: 100ppm/°C; Item Type: Resistor; Supplier 1: Avnet; Manufacturer Part Number: RC0603FR-0722K1L; RoHS: Yes; Category: Chip SMD Resistors; Stock 1: 595000; Pricing 1: 5000=0.00133, 10000=0.00131, 20000=0.00127 (USD); Case/Package: 0603; Case Code (Imperial): 0603; Case Code (Metric): 1608; Size Code: 0603; Min Operating Temperature: -55°C; Max Operating Temperature: 155°C; Tolerance: 1%; Package Quantity: 5000; Packaging: Tape and Reel; Termination: SMD/SMT; Voltage Rating (DC): 50V; Series: RC; Length: 1.6mm; Width: 0.8mm; Height: 0.45mm; Lead Free: Lead Free; RoHS Compliant: Yes; ComponentLink1URL: https://datasheet.ciiva.com/12555/rc0603-272842-12555287.pdf?src-supplier=Mouser; ComponentLink1Description: https://datasheet.ciiva.com/12555/rc0603-272842-12555287.pdf?src-supplier=Mouser; Supplier Part Number 1: RC0603FR-0722K1L; LCSC Part Number: C137768
R43 = RC0603FR-0747K5L: RES 47.5K OHM 1% 1/10W 0603; Manufacturer: Yageo; Resistance: 47.5kR; Power Rating: 100mW; Voltage Rating: 50V; Temperature Coefficient: 100ppm/°C; Item Type: Resistor; Supplier 1: Avnet; Manufacturer Part Number: RC0603FR-0747K5L; RoHS: Yes; Category: Chip SMD Resistors; Stock 1: 20000; Pricing 1: 5000=0.00133, 10000=0.00131, 20000=0.00127 (USD); Case/Package: 0603; Number of Pins: 2; Case Code (Metric): 1608; Case Code (Imperial): 0603; Size Code: 0603; Min Operating Temperature: -55°C; Max Operating Temperature: 155°C; Tolerance: 1%; Package Quantity: 5000; Packaging: Tape and Reel; Resistor Type: Thick Film; Number of Terminations: 2; Termination: SMD/SMT; Max Power Dissipation: 100mW; Voltage Rating (DC): 50V; Features: Moisture Resistant; Series: RC; Technology: THICK FILM; Construction: Rectangular; Resistance Tolerance: 1%; Length: 1.6mm; Width: 0.031inch; Height: 0.45mm; Depth: 0.8mm; RoHS Compliant: Yes; Reach SVHC Compliant: Yes; Military Standard: Not; Lead Free: Lead Free; ComponentLink1URL: https://datasheet.ciiva.com/11808/0900766b80f96399-11808343.pdf?src-supplier=RSComponents; ComponentLink1Description: https://datasheet.ciiva.com/11808/0900766b80f96399-11808343.pdf?src-supplier=RSComponents; ComponentLink2URL: https://datasheet.ciiva.com/2454/pyu-r-int-thick-7-2454790.pdf?src-supplier=Digi-Key; ComponentLink2Description: https://datasheet.ciiva.com/2454/pyu-r-int-thick-7-2454790.pdf?src-supplier=Digi-Key; ComponentLink3URL: https://datasheet.ciiva.com/2454/pyu-r-int-thick-7-2454791.pdf?src-supplier=Digi-Key; ComponentLink3Description: https://datasheet.ciiva.com/2454/pyu-r-int-thick-7-2454791.pdf?src-supplier=Digi-Key; ComponentLink4URL: https://datasheet.ciiva.com/2454/pyu-r-int-thick-7-2454789.pdf?src-supplier=Digi-Key; ComponentLink4Description: https://datasheet.ciiva.com/2454/pyu-r-int-thick-7-2454789.pdf?src-supplier=Digi-Key; ComponentLink5URL: https://datasheet.ciiva.com/12555/rc0603-272842-12555285.pdf?src-supplier=Mouser; ComponentLink5Description: https://datasheet.ciiva.com/12555/rc0603-272842-12555285.pdf?src-supplier=Mouser; ComponentLink6URL: https://datasheet.ciiva.com/15189/getdatasheetpartid-135115-15189741.pdf?src-supplier=Verical; ComponentLink6Description: https://datasheet.ciiva.com/15189/getdatasheetpartid-135115-15189741.pdf?src-supplier=Verical; Supplier Part Number 1: RC0603FR-0747K5L; LCSC Part Number: C137715
R173 R174 R247 = RC0402FR-070RL: RES 0 OHM JUMPER 1/16W 0402; Manufacturer: Yageo; Tolerance: 1%; Power Rating: 62.5mW; Voltage Rating: 50V; Temperature Coefficient: 200ppm/°C; Max Power Dissipation: 63mW; Supplier 1: Mouser; Manufacturer Part Number: RC0402FR-070RL; RoHS: Yes; Category: Chip SMD Resistors; Stock 1: 8556842; Pricing 1: 1=0.10000, 10=0.01400, 50=0.01400, 100=0.00600, 1000=0.00300, 5000=0.00200, 10000=0.00100 (USD); Mount: Surface Mount; Case/Package: 0402; Contact Plating: Tin,Matte; Case Code (Imperial): 0402; Case Code (Metric): 1005; Size Code: 0402; Min Operating Temperature: -55°C; Max Operating Temperature: 155°C; Resistance: 0R; Resistor Type: Thick Film; Packaging: Tape and Reel; Termination: SMD/SMT; Features: Moisture Resistant; Series: RC; Number of Terminations: 2; Length: 1mm; Width: 0.5mm; Height: 0.35mm; Radiation Hardening: No; Lead Free: Lead Free; RoHS Compliant: Yes; ComponentLink1URL: https://datasheet.ciiva.com/8896/pyu-rc0402-51-rohs-l-6-8896149.pdf?src-supplier=Avnet; ComponentLink1Description: https://datasheet.ciiva.com/8896/pyu-rc0402-51-rohs-l-6-8896149.pdf?src-supplier=Avnet; ComponentLink2URL: https://datasheet.ciiva.com/16790/pyu-rc0402-51-rohs-l-6-r-16790444.pdf?src-supplier=Future+Electronics; ComponentLink2Description: https://datasheet.ciiva.com/16790/pyu-rc0402-51-rohs-l-6-r-16790444.pdf?src-supplier=Future+Electronics; Supplier Part Number 1: 603-RC0402FR-070RL; LCSC Part Number: C106231
SB1 = Solder Bridge 0402: Solder Bridge ON; Manufacturer Part Number: Solder Bridge 0402; Item Type: Solder Bridge
U21 = CP2102N-A02-GQFN24R: IC USB TO UART BRIDGE QFN24; Manufacturer: Silicon Labs; Supplier 1: Digi-Key; Manufacturer Part Number: CP2102N-A02-GQFN24R; RoHS: Yes; Category: Interface ICs; Pricing 1: 1=1.56000 (USD); Supplier Part Number 1: 336-5888-1-ND